# Altium project nrf52810_qcaa.PrjPCB
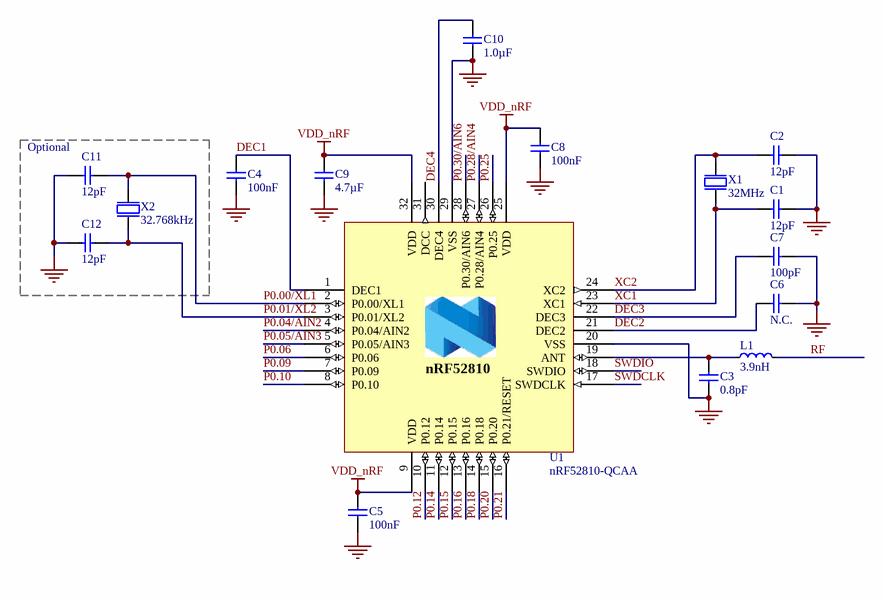
[diagram p0: nrf52810_qcaa.SchDoc]
1 sheet, 16 parts. Net scope: global (net labels, ports and power ports of the same name join across sheets).
Board file: nrf52810_qcaa.PcbDoc

## Sheet nrf52810_qcaa.SchDoc: nRF52810-QCAA Reference Layout
size A4; Revision: 1.0; SheetNumber: 1; SheetTotal: 1; DrawnBy: RUBR; DocumentSize: A4; PCAName: nRF52810-QCAA Reference Layout

### Parts
C1  12pF  [CAPC1005X04L]
C2  12pF  [CAPC1005X04L]
C3  0.8pF  [CAPC1005X04L]
C4  100nF  [CAPC1005X04L]
C5  100nF  [CAPC1005X04L]
C6  N.C.  [CAPC1005X04L]
C7  100pF  [CAPC1005X04L]
C8  100nF  [CAPC1005X04L]
C9  4.7µF  [CAPC1608X06L]
C10  1.0µF  [CAPC1608X06L]
C11  12pF  [CAPC1005X04L]
C12  12pF  [CAPC1005X04L]
L1  3.9nH  [INDC1005X04L]
U1  nRF52810-QCAA  [Nordic_QFN50P500X500X90-33N]
X1  32MHz  [BT-XTAL_2016]
X2  32.768kHz  [XTAL_3215]

### Blocks framed on the sheet
Optional: C11 C12 X2

### Nets
GND: C1.2 C2.2 C3.1 C4.2 C5.2 C6.1 C7.2 C8.2 C9.2 C10.1 C11.2 C12.2 U1.20(VSS) U1.29(VSS) U1.33 X1.2(GND) X1.4(GND)
VDD_nRF: C5.1 C8.1 C9.1 U1.9(VDD) U1.25(VDD) U1.32(VDD)
DEC1: C4.1 U1.1(DEC1)
DEC2: C6.2 U1.21(DEC2)
DEC3: C7.1 U1.22(DEC3)
DEC4: C10.2 U1.30(DEC4)
P0.00/XL1: C11.1 U1.2(P0.00/XL1) X2.1(inp)
P0.01/XL2: C12.1 U1.3(P0.01/XL2) X2.2(out)
P0.04/AIN2: U1.4(P0.04/AIN2)
P0.05/AIN3: U1.5(P0.05/AIN3)
P0.06: U1.6(P0.06)
P0.09: U1.7(P0.09)
P0.10: U1.8(P0.10)
P0.12: U1.10(P0.12)
P0.14: U1.11(P0.14)
P0.15: U1.12(P0.15)
P0.16: U1.13(P0.16)
P0.18: U1.14(P0.18)
P0.20: U1.15(P0.20)
P0.21: U1.16(P0.21/RESET)
P0.25: U1.26(P0.25)
P0.28/AIN4: U1.27(P0.28/AIN4)
P0.30/AIN6: U1.28(P0.30/AIN6)
RF: L1.2
SWDCLK: U1.17(SWDCLK)
SWDIO: U1.18(SWDIO)
XC1: C1.1 U1.23(XC1) X1.1(inp)
XC2: C2.1 U1.24(XC2) X1.3(out)
NetC3_2: C3.2 L1.1 U1.19(ANT)

Not connected (* = marked no-connect by the designer): U1 31(DCC)

### Notes on the sheet
- Title
- Size
- Date:
- Project Number
- Sheet         of
- Revision
- File:
- Drawn By:
- (in symbol nRF52810-QCAA) nRF52810

### Library data of the parts
C1 C2 C11 C12 = C0402-12p: Capacitor, NP0, ±2%; Note: 50V; Part Number: C0402-12p; LatestRevisionDate: 2011-05-11; Pin Count: 2; Publisher: Nordic Semiconductor; Published: 2009-05-08; Value: 12pF; Footprint Doc: 0402; Manufacturer: *; Manufacturer Part Number: *
C3 = C0402-0.8p: Capacitor, NP0, ±5%; Note: 50V; Part Number: C0402-0.8p; LatestRevisionDate: 2012-11-21; Pin Count: 2; Publisher: Nordic Semiconductor; Published: 2009-05-08; Value: 0.8pF; Footprint Doc: 0402; Manufacturer: *; Manufacturer Part Number: *
C4 C5 C8 = C0402-100n: Capacitor, X7R, ±10%; Note: 16V; Part Number: C0402-100n; LatestRevisionDate: 2009-11-23; Pin Count: 2; Publisher: Nordic Semiconductor; Published: 2009-05-08; Value: 100nF; Footprint Doc: 0402; Manufacturer: *; Manufacturer Part Number: *
C6 = C0402-N.C.: Not mounted; Assembly: Not mounted; Part Number: C0402-N.C.; LatestRevisionDate: 2009-05-08; Pin Count: 2; Publisher: Nordic Semiconductor; Published: 2009-05-08; Value: N.C.; Footprint Doc: 0402; Manufacturer: *; Manufacturer Part Number: *
C7 = C0402-100p: Capacitor, NP0, ±5%; Note: 50V; Part Number: C0402-100p; LatestRevisionDate: 2009-05-08; Pin Count: 2; Publisher: Nordic Semiconductor; Published: 2009-05-08; Value: 100pF; Footprint Doc: 0402; Manufacturer: *; Manufacturer Part Number: *
C9 = C0603-4µ7: Capacitor, X5R, ±10%; Note: 6.3V; Part Number: C0603-4µ7; LatestRevisionDate: 2009-11-23; Pin Count: 2; Publisher: Nordic Semiconductor; Published: 2009-05-08; Value: 4.7µF; Footprint Doc: 0603; Manufacturer: *; Manufacturer Part Number: *
C10 = C0603-1µ0: Capacitor, X7R, ±10%; Note: 16V; Part Number: C0603-1µ0; LatestRevisionDate: 2013-06-05; Pin Count: 2; Publisher: Nordic Semiconductor; Published: 2009-05-08; Value: 1.0µF; Footprint Doc: 0603; Manufacturer: *; Manufacturer Part Number: *
L1 = L0402-3n9: High frequency chip inductor ±5%; Part Number: L0402-3n9; LatestRevisionDate: 2012-09-19; Pin Count: 2; Publisher: Nordic Semiconductor; Published: 2009-05-08; Value: 3.9nH; Footprint Doc: 0402
U1 = nRF52810-QCAA: Multi-protocol Bluetooth Low Energy, ANT and 2.4GHz proprietary system-on-chip; Manufacturer: Nordic Semiconductor; Note: nRF52810 - QFN32 5x5 0.5mm pitch; Part Number: nRF52810-QCAA; LatestRevisionDate: 2017-08-21; Pin Count: 32; Publisher: Nordic Semiconductor; Published: 2017-08-21; Value: nRF52810-QCAA; Footprint Doc: QFN-32; Manufacturer Part Number: nRF52810-QCAA
X1 = XTAL_SMD2016_32MHz_8pF_General: XTAL SMD 2016, 32MHz, Cl=8pF, Total Tol: ±40ppm; Part Number: XTAL_SMD2016_32MHz_8pF_General; LatestRevisionDate: 2016-08-19; Pin Count: 4; Publisher: Nordic Semiconductor; Published: 2016-08-19; Value: 32MHz; Footprint Doc: XTAL_2016; Manufacturer: *; Manufacturer Part Number: *
X2 = XTAL_SMD3215_32.768kHz_9pF_General: XTAL SMD 3215, 32.768kHz, Cl=9pF, Total Tol: ±50ppm; Part Number: XTAL_SMD3215_32.768kHz_9pF_General; LatestRevisionDate: 2016-08-19; Pin Count: 2; Publisher: Nordic Semiconductor; Published: 2016-08-19; Value: 32.768kHz; Footprint Doc: XTAL_3215; Manufacturer: *; Manufacturer Part Number: *